# Altium schematic sheet v1.0.SchDoc
size 127 x 38 mm
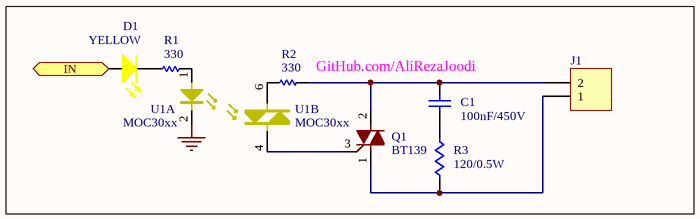
[diagram p0: v1.0.SchDoc]

## Parts
C1  100nF/450V  [CAPR7.62-6.8x5]
D1  YELLOW  [LED_THD_3MM_YELLOW_R]
J1  2PIN  [Fonics_2PIN_1]  (value not drawn)
Q1  BT139  [TO220_3PIN_V]
R1  330  [R_THD_AXIAL0.4(1/4W)]
R2  330  [R_THD_AXIAL0.4(1/4W)]
R3  120/0.5W  [AXIAL-0.4]
U1  MOC30xx  [DIP_6]  (parts A,B of 2)

## Ports
IN (in)

## Nets
GND: U1.2(K)
IN: D1.1(A) ; port IN
NetC1_1: C1.1 R3.2
NetC1_2: C1.2 J1.2 Q1.2(T2) R2.2
NetD1_2: D1.2(K) R1.1
NetJ1_1: J1.1 Q1.1(T1) R3.1
NetQ1_3: Q1.3(G) U1.4(A/K)
NetR1_2: R1.2 U1.1(A)
NetR2_1: R2.1 U1.6(A/K)

## Notes on the sheet
- GitHub.com/AliRezaJoodi

## Library data of the parts
C1 = Cap: Capacitor; Manufacturer: Generic Components; Class I: Passive; Published: 8-Jun-2000; Revision: July-2002: Re-released for DXP Platform.; Publisher: Altium Limited; Class II: Capacitor
D1 = LED_YELLOW: LED, Yellow; Manufacturer: Generic Components; Class I: Optoelectronic; Published: 8-Jun-2000; Revision: July-2002: Re-released for DXP Platform.; Publisher: Altium Limited; Class II: LED
J1 = Header 2: Header, 2-Pin; LatestRevisionDate: 17-Jul-2002; LatestRevisionNote: Re-released for DXP Platform.; Publisher: Altium Limited
Q1 = Triac: Triac,
R1 R2 = Resistor: Revision: July-2002: Re-released for DXP Platform.
R3 = Res1: Resistor; Manufacturer: Generic Components; Class I: Passive; Published: 8-Jun-2000; Revision: July-2002: Re-released for DXP Platform.; Publisher: Altium Limited; Class II: Resistor
U1 = MOC3021: Opto-Triac